# EAGLE design Board (EAGLE 9.6.2)
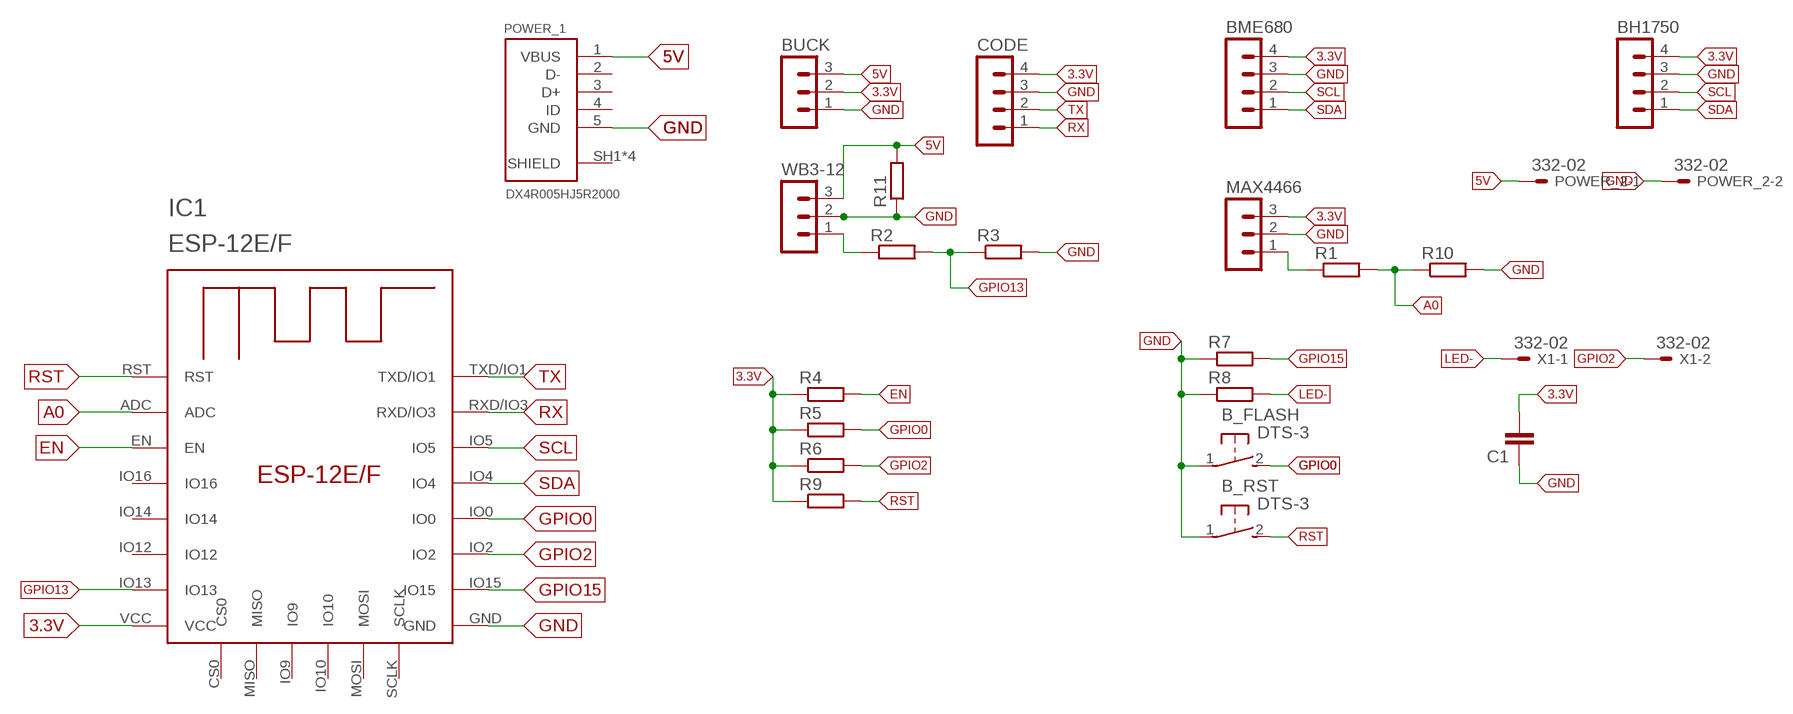
[diagram p0: schematic, sheet 1]

## Parts
B_FLASH  DTS-3  [DTS-3]
B_RST  DTS-3  [DTS-3]
BH1750  MA04-1  [MA04-1]
BME680  MA04-1  [MA04-1]
BUCK  MA03-1  [MA03-1]
C1  C-EU025-024X044  [C025-024X044]
CODE  MA04-1  [MA04-1]
IC1  ESP-12E/F  [ESP-12E]
MAX4466  MA03-1  [MA03-1]
POWER_1  DX4R005HJ5R2000  [DX4R005HJ5R2000]
POWER_2  332-02  [332-02]
R1  R-EU_0207/10  [0207/10]
R2  R-EU_0207/10  [0207/10]
R3  R-EU_0207/10  [0207/10]
R4  R-EU_0207/10  [0207/10]
R5  R-EU_0207/10  [0207/10]
R6  R-EU_0207/10  [0207/10]
R7  R-EU_0207/10  [0207/10]
R8  R-EU_0207/10  [0207/10]
R9  R-EU_0207/10  [0207/10]
R10  R-EU_0207/10  [0207/10]
R11  R-EU_0207/10  [0207/10]
WB3-12  MA03-1  [MA03-1]
X1  332-02  [332-02]

## Nets
3.3V: BH1750.4 BME680.4 BUCK.2 C1.2 CODE.4 IC1.VCC MAX4466.3 R4.1 R5.1 R6.1 R9.1
5V: BUCK.3 POWER_1.1(VBUS) POWER_2.1 R11.2 WB3-12.3
A0: IC1.ADC R1.2 R10.1
EN: IC1.EN R4.2
GND: B_FLASH.1 B_RST.1 BH1750.3 BME680.3 BUCK.1 C1.1 CODE.3 IC1.GND MAX4466.2 POWER_1.5(GND) POWER_2.2 R3.2 R7.1 R8.1 R10.2 R11.1 WB3-12.2
GPIO0: B_FLASH.2 IC1.IO0 R5.2
GPIO2: IC1.IO2 R6.2 X1.2
GPIO13: IC1.IO13 R2.2 R3.1
GPIO15: IC1.IO15 R7.2
LED-: R8.2 X1.1
N$1: MAX4466.1 R1.1
N$3: R2.1 WB3-12.1
RST: B_RST.2 IC1.RST R9.2
RX: CODE.1 IC1.RXD/IO3
SCL: BH1750.2 BME680.2 IC1.IO5
SDA: BH1750.1 BME680.1 IC1.IO4
TX: CODE.2 IC1.TXD/IO1
Unconnected: IC1.CS0 IC1.IO9 IC1.IO10 IC1.IO12 IC1.IO14 IC1.IO16 IC1.MISO IC1.MOSI IC1.SCLK POWER_1.2(D-) POWER_1.3(D+) POWER_1.4(ID)

## Power pins joined to a net without a drawn wire
SHIELD: POWER_1.SH1(SHIELD) POWER_1.SH2(SHIELD) POWER_1.SH3(SHIELD) POWER_1.SH4(SHIELD)

## Library data of the parts
B_FLASH B_RST = switch-tact:DTS-3
BH1750 BME680 CODE = con-lstb:MA04-1: PIN HEADER; OC_FARNELL: unknown; OC_NEWARK: unknown
BUCK MAX4466 WB3-12 = con-lstb:MA03-1: PIN HEADER; OC_FARNELL: unknown; OC_NEWARK: unknown
C1 = rcl:C-EU: CAPACITOR, European symbol; SPICEPREFIX: C
IC1 = esp-12e-f:ESP-12E/F
POWER_1 = USB connector:DX4R005HJ5R2000: CONN RCPT USB2.0 MICRO B SMD R/A Manufacturer's datasheet <https://www.jae.com/direct/topics/topics_file_download/topics_id=64360&ext_no=08&_lang=en>; CREATED_BY: PCBLayout.com; DIGIKEY_PARTNO: 670-2674-2-ND; MANUFACTURER: JAE Electronics; MPN: DX4R005HJ5R2000
POWER_2 X1 = con-garry:332-02: 2 Pin - 2mm Dual Row Source: www.mpe-connector.de / garry_shortform_2012.pdf
R1-R11 = resistor:R-EU_: RESISTOR, European symbol

## Board
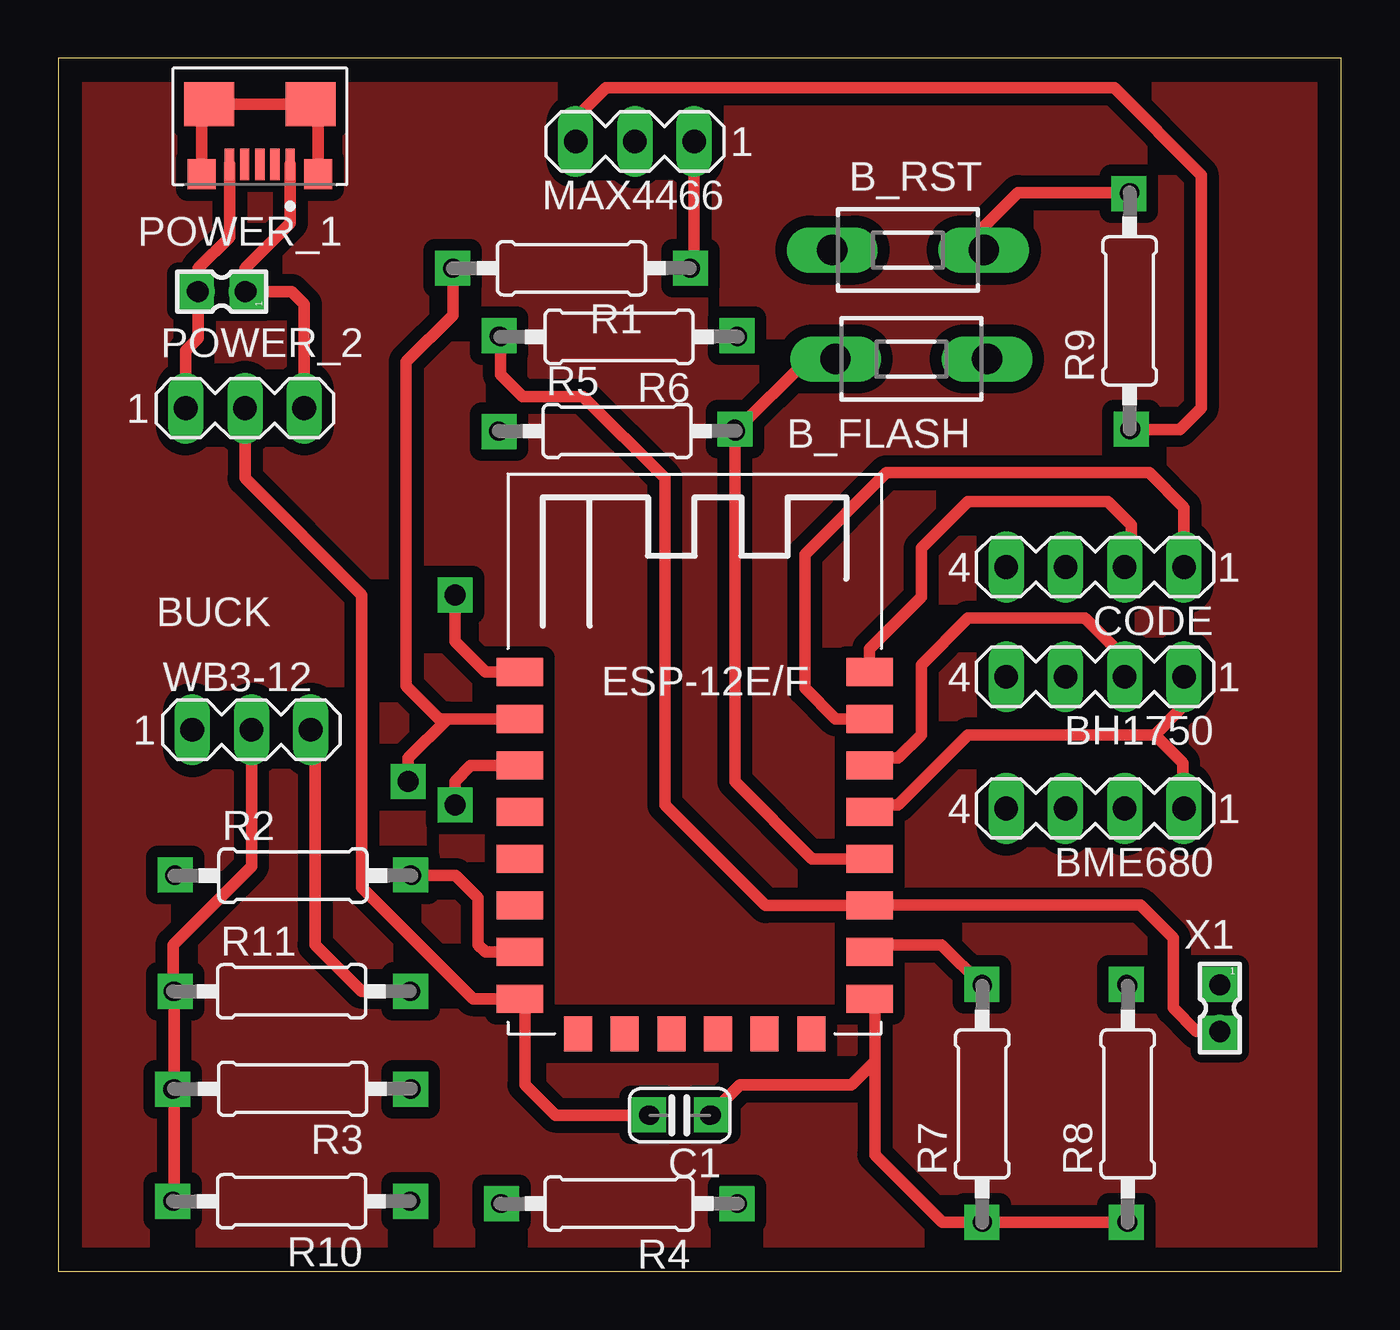
[diagram p1: board, top side]
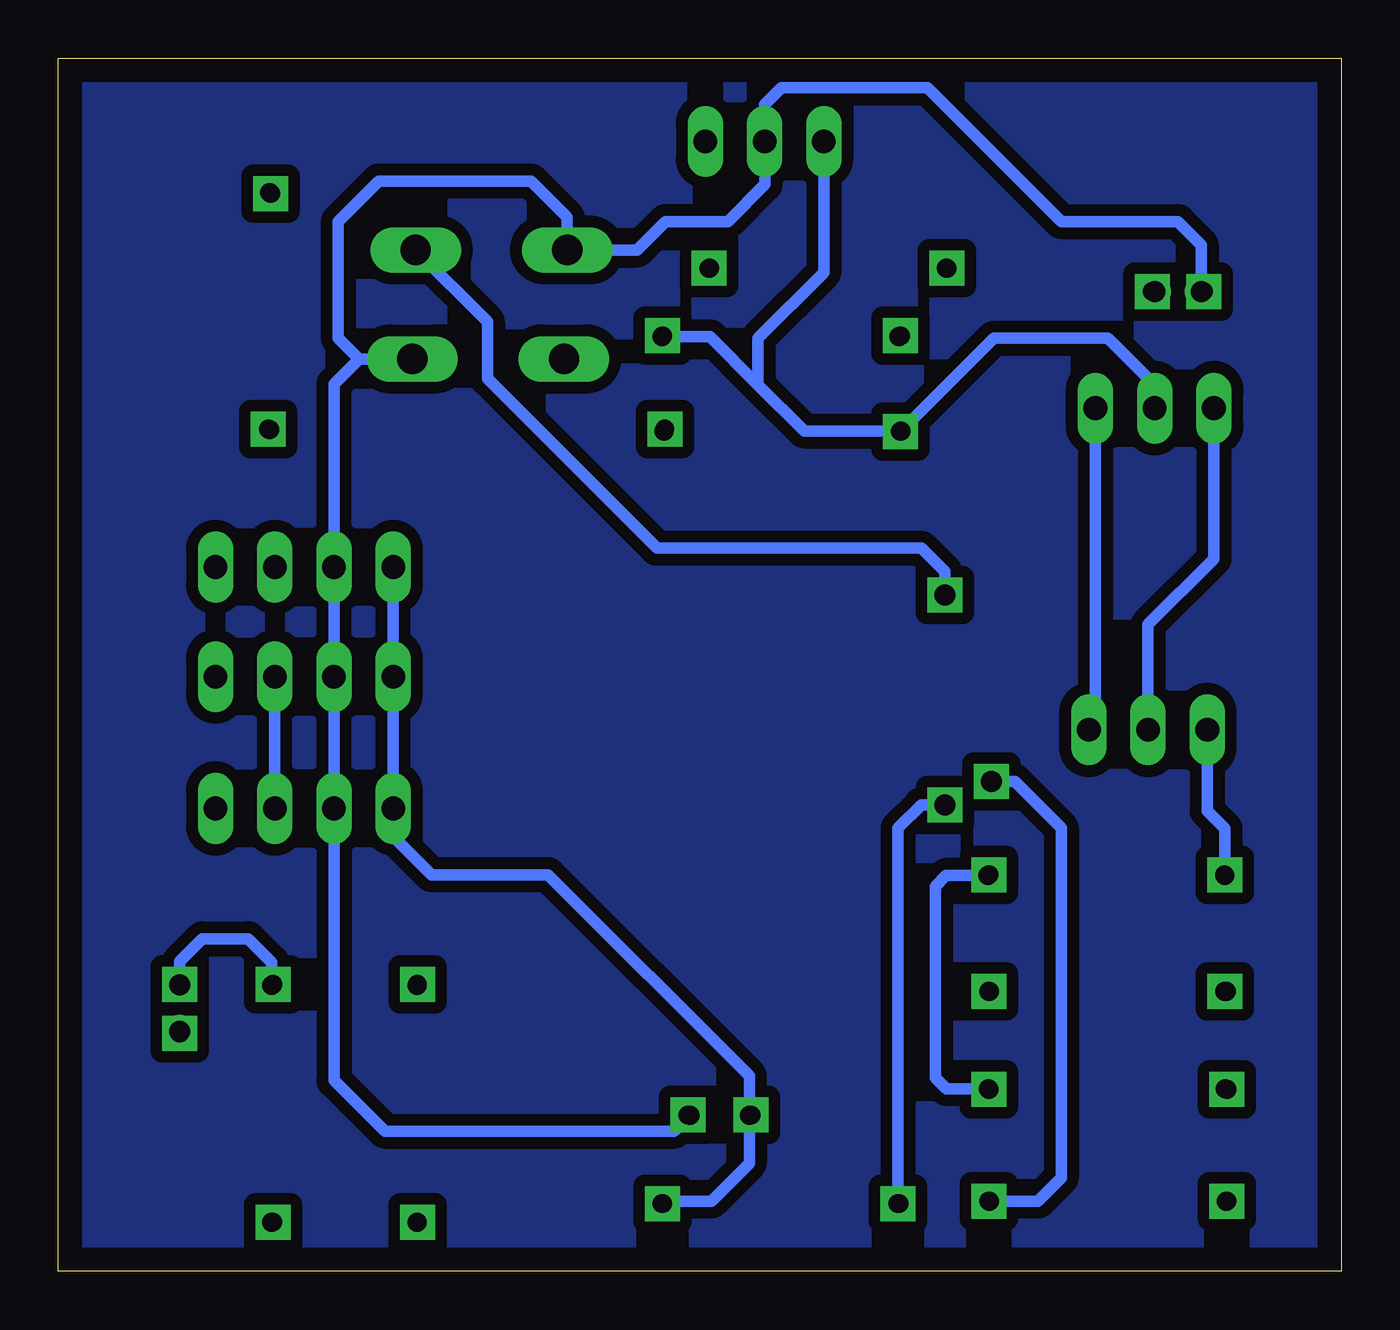
[diagram p2: board, bottom side, seen from below]

Size 55 x 52 mm. Coordinates in mm from the lower left corner, seen from the top.
Outline: 0,0 55,0 55,52 0,52 0,0
Copper layers (1*16): Top 0.035mm / dielectric 1.5mm / Bottom 0.035mm
Design rules "default": minimum track width 6mil, minimum drill 0.35mm, track to track 6mil, track to pad 6mil, pad to pad 6mil, via to via 6mil, smd to smd 6mil, copper to edge 40mil, drill to drill 6mil, minimum pad ring 10mil, minimum via ring 8mil, stop-mask expansion 4mil, vias tented up to drill 0mil, thermal gap 10mil

### Footprints (pad centres in the part's own frame; a part is rotated, then mirrored left to right if it is on the bottom)
DTS-3 = drill 1.3 long: 1 -3.25,0; 2 3.25,0
MA04-1 = drill 1.016 long: 1 -3.81,0; 2 -1.27,0; 3 1.27,0; 4 3.81,0
MA03-1 = drill 1.016 long: 1 -2.54,0; 2 0,0; 3 2.54,0
C025-024X044 = drill 0.813 octagon: 1 -1.27,0; 2 1.27,0
ESP-12E = smd 2 x 1.2: ADC -7.46,5.53; EN -7.46,3.53; GND 7.54,-6.47; IO0 7.54,-0.47; IO2 7.54,-2.47; IO4 7.54,1.53; IO5 7.54,3.53; IO12 -7.46,-2.47; IO13 -7.46,-4.47; IO14 -7.46,-0.47; IO15 7.54,-4.47; IO16 -7.46,1.53; RST -7.46,7.53; RXD/IO3 7.54,5.53; TXD/IO1 7.54,7.53; VCC -7.46,-6.47 | smd 1.2 x 1.5: CS0 -4.96,-7.97; IO9 -0.96,-7.97; IO10 1.04,-7.97; MISO -2.96,-7.97; MOSI 3.04,-7.97; SCLK 5.04,-7.97
DX4R005HJ5R2000 = smd 0.4 x 1.35: 1 -1.3,4.125; 2 -0.65,4.125; 3 0,4.125; 4 0.65,4.125; 5 1.3,4.125 | smd 1.2 x 1.3: SH1 -2.5,4.55; SH2 2.5,4.55 | smd 2.15 x 1.9: SH3 -2.175,1.55; SH4 2.175,1.55
332-02 = drill 0.9 pad 1.27: 1 0,-1; 2 0,1
0207/10 = drill 0.813 octagon: 1 -5.08,0; 2 5.08,0

### Placement (x,y rotation side)
B_FLASH  36.57,39.11 180 top
B_RST  36.43,43.78 0 top
BH1750  44.45,25.49 180 top
BME680  44.45,19.84 180 top
BUCK  8,37 0 top
C1  26.64,6.69 180 top
CODE  44.45,30.19 180 top
IC1  27.24,18.15 0 top
MAX4466  24.72,48.44 180 top
POWER_1  8.64,51.58 180 top
POWER_2  7,42 90 top
R1  22,43 180 top
R2  10.06,16.96 0 top
R3  10.04,7.82 180 top
R4  24.04,2.9 180 top
R5  23.96,36.02 0 top
R6  24.04,40.06 180 top
R7  39.61,7.17 90 top
R8  45.85,7.17 90 top
R9  45.93,41.17 90 top
R10  10,3 180 top
R11  10,12 0 top
WB3-12  8.28,23.21 0 top
X1  49.8,11.28 180 top

### Tracks (layer width: path | path; a pad name or v marks a point on that pad's centre or on a via)
3.3V
  Top 0.5: BUCK.2 8,34 13,29 13,16.46 17.78,11.68 IC1.VCC 20,11.46 20,8 21.31,6.69 C1.2 | MAX4466.3 22.18,49.44 23.47,50.73 45.27,50.73 49,47 49,37 48.09,36.09 R9.1
  Bottom 0.5: CODE.4 BH1750.4 BME680.4 40.64,18.64 39,17 34,17 25.37,8.37 C1.2 25.37,4.63 27,3 29.02,3 R4.1 | R6.1 27.06,40.06 25,38 | 25,38 23.02,36.02 R5.1 14.9,40 10,40 8,38 BUCK.2 | MAX4466.3 22.18,42.82 25,40 25,38
5V
  Top 0.5: POWER_1.1 9.94,44.94 8,43 POWER_2.1 10,42 10.54,41.46 BUCK.3 | WB3-12.3 11,23.03 11,14 13,12 R11.2
  Bottom 0.5: BUCK.3 10.54,23.49 WB3-12.3
A0  (via drill 0.8 pad 1.5, 0.9 pad 1.1)
  Top 0.5: R1.2 16.92,41 14.92,39 14.92,25.08 16.32,23.68 16.68,23.68 | 16.68,23.68 IC1.ADC | v15,21 15,22 16.68,23.68
  Bottom 0.5: v15,21 14,21 12,19 12,4 13,3 R10.1
EN  (via drill 0.8 pad 1.5, 0.9 pad 1.1)
  Top 0.5: IC1.EN 17.68,21.68 17,21 v17,20
  Bottom 0.5: R4.2 19,2.94 19,19 18,20 v17,20
GND
  Top 0.5: POWER_1.5 7.34,44.34 6,43 POWER_2.2 6,40 5.46,39.46 BUCK.1 | IC1.GND 35,11.46 35,9 | 35,9 35,5 37.91,2.09 R7.1 R8.1 | WB3-12.2 8.28,17.36 4.92,14 R11.1 4.96,11.96 R3.2 4.96,3.04 R10.2 | C1.1 29.22,8 34,8 35,9
  Bottom 0.5: C1.1 28.6,6 41,6 43.18,8.18 BME680.3 BH1750.3 CODE.3 43.18,38.04 42.11,39.11 | BUCK.1 5.46,30.54 8.28,27.72 WB3-12.2 | POWER_2.2 6,44 7,45 12,45 17.73,50.73 24,50.73 24.72,50.01 MAX4466.2 24.7,48.42 24.7,46.6 26.3,45 28.96,45 30.18,43.78 B_RST.1 33.18,45.18 34.73,46.73 41.27,46.73 43,45 43,40 42.11,39.11 | B_FLASH.1 42.11,39.11
GPIO0
  Top 0.5: IC1.IO0 32.32,17.68 29,21 29,35.98 R5.2 32.13,39.11 B_FLASH.2
GPIO2
  Top 0.5: X1.2 48.8,10.28 47.8,11.28 47.8,14.28 46.38,15.7 34.8,15.7 IC1.IO2 30.32,15.68 26,20 26,34 22.5,37.5 19.9,37.5 18.96,38.44 R6.2
GPIO13
  Top 0.5: R2.2 17.04,16.96 18,16 18,14 18.32,13.68 IC1.IO13
  Bottom 0.5: R3.1 16.92,7.82 17.4,8.3 17.4,16.5 16.94,16.96 R2.2
GPIO15
  Top 0.5: IC1.IO15 35.1,14 37.86,14 R7.2
LED-
  Bottom 0.5: R8.2 45.85,13.25 46.85,14.25 48.83,14.25 49.8,13.28 X1.1
N$1
  Top 0.5: MAX4466.1 27.26,43.18 R1.1
N$2  (via drill 0.8 pad 1.5)
  other vias: 45.9,46.2
N$3
  Bottom 0.5: WB3-12.1 5.74,19.74 4.98,18.98 R2.1
N$4  (via drill 0.8 pad 1.5)
  other vias: 46,36.1
N$5  (via drill 0.8 pad 1.5)
  other vias: 16.9,43
N$6  (via drill 0.8 pad 1.5)
  other vias: 27.1,43
N$7  (via drill 0.8 pad 1.5)
  other vias: 18.9,40.1
N$8  (via drill 0.8 pad 1.5)
  other vias: 29.1,40.1
N$9  (via drill 0.8 pad 1.5)
  other vias: 18.9,36
N$10  (via drill 0.8 pad 1.5)
  other vias: 29,36.1
N$11  (via drill 0.8 pad 1.5)
  other vias: 5,17
N$12  (via drill 0.8 pad 1.5)
  other vias: 15.1,17
N$13  (via drill 0.8 pad 1.5)
  other vias: 15.1,12
N$14  (via drill 0.8 pad 1.5)
  other vias: 5,12
N$15  (via drill 0.8 pad 1.5)
  other vias: 4.9,7.8
N$16  (via drill 0.8 pad 1.5)
  other vias: 4.9,3
N$17  (via drill 0.8 pad 1.5)
  other vias: 15.1,3
N$18  (via drill 0.8 pad 1.5)
  other vias: 19,2.9
N$19  (via drill 0.8 pad 1.5)
  other vias: 15.1,7.8
N$20  (via drill 0.8 pad 1.5)
  other vias: 25.3,6.7
N$21  (via drill 0.8 pad 1.5)
  other vias: 28,6.7
N$22  (via drill 0.8 pad 1.5)
  other vias: 29.1,2.9
N$23  (via drill 0.8 pad 1.5)
  other vias: 39.6,2.1
N$24  (via drill 0.8 pad 1.5)
  other vias: 45.8,2.1
N$25  (via drill 0.8 pad 1.5)
  other vias: 39.6,12.3
N$26  (via drill 0.8 pad 1.5)
  other vias: 45.8,12.3
N$27  (via drill 0.8 pad 1.5)
  other vias: 49.8,12.3
N$28  (via drill 0.8 pad 1.5)
  other vias: 49.8,10.2
N$29  (via drill 0.8 pad 1.5)
  other vias: 5.9,42
N$30  (via drill 0.8 pad 1.5)
  other vias: 8.1,42
RST  (via drill 0.8 pad 1.5, 0.9 pad 1.1)
  Top 0.5: B_RST.2 39.68,44.78 41.15,46.25 R9.2 | IC1.RST 18.32,25.68 17,27 v17,29
  Bottom 0.5: B_RST.2 36.6,40.7 36.6,38.27 29.33,31 18,31 17,30 v17,29
RX
  Top 0.5: IC1.RXD/IO3 33.32,23.68 32,25 32,30.73 35.5,34.23 46.77,34.23 48.26,32.74 CODE.1
SCL
  Top 0.5: IC1.IO5 35.1,22 36,22 37,23 37,26 39,28 44,28 45.72,26.28 BH1750.2
  Bottom 0.5: BME680.2 BH1750.2
SDA
  Top 0.5: IC1.IO4 35.1,20 36,20 39,23 47,23 | 47,23 48.26,24.26 BH1750.1 | BME680.1 48.2,19.9 48.2,21.8 47,23
SHIELD
  Top 0.5: POWER_1.SH2 6.14,49.7 POWER_1.SH4 POWER_1.SH3 11.14,49.7 POWER_1.SH1
TESTE
  pour Top (isolate 0.5): 0,52 0,0 55,0 55,52
  pour Bottom (isolate 0.5): 0,52 0,0 55,0 55,52
TX
  Top 0.5: 35.1,26 IC1.TXD/IO1 34.78,26.68 37,28.9 37,31 39,33 45,33 46,32 46,30.47 CODE.2